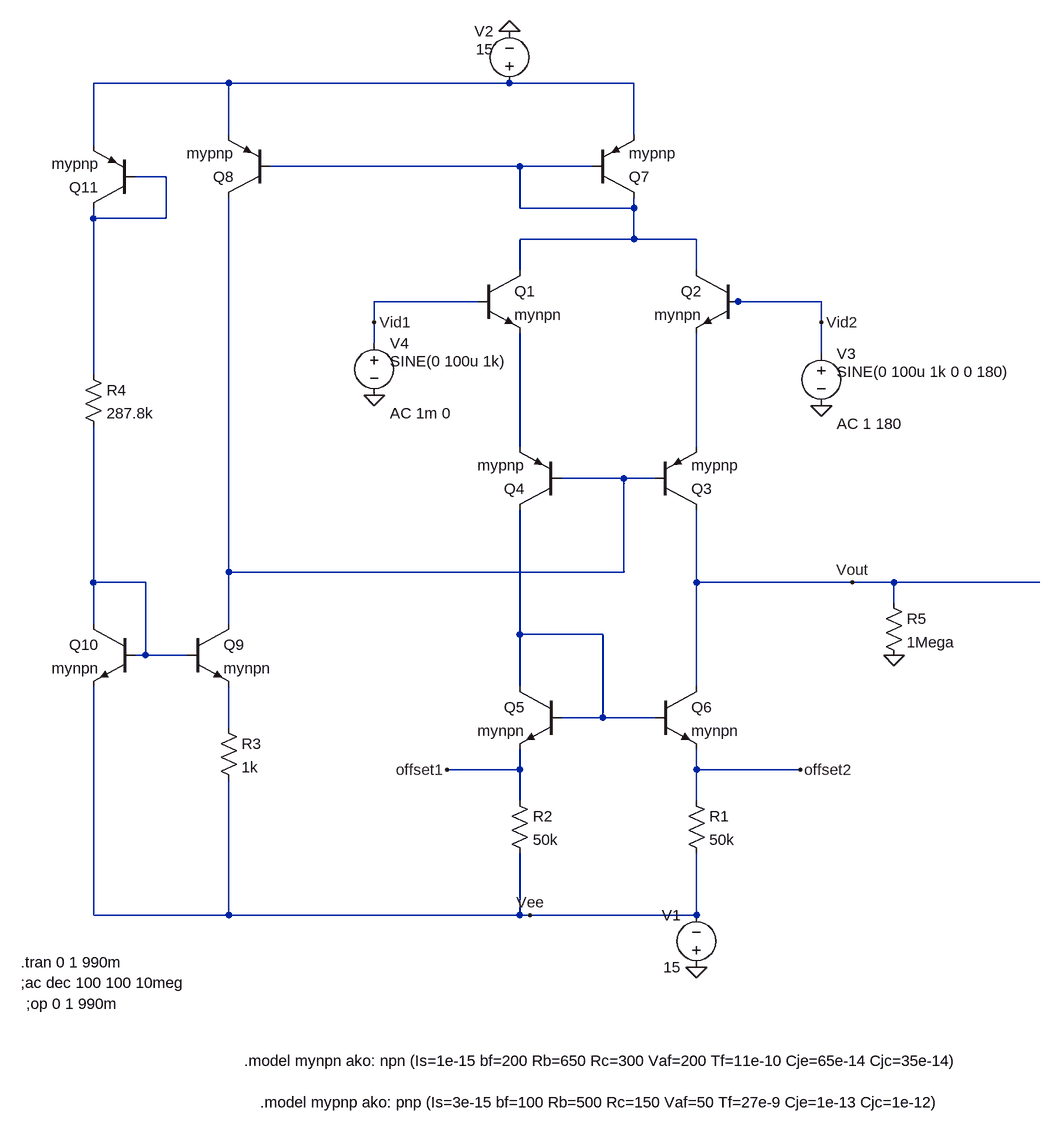
[diagram p0: schematic main circuit without offset.asc]
main circuit without offset.asc, the LTspice schematic file:
Version 4
SHEET 1 1844 1424
WIRE -272 -160 -480 -160
WIRE 160 -160 -272 -160
WIRE 352 -160 160 -160
WIRE -272 -80 -272 -160
WIRE 352 -80 352 -160
WIRE -480 -64 -480 -160
WIRE 176 -32 -208 -32
WIRE 288 -32 176 -32
WIRE -368 -16 -416 -16
WIRE 176 32 176 -32
WIRE 352 32 352 16
WIRE 352 32 176 32
WIRE -480 48 -480 32
WIRE -368 48 -368 -16
WIRE -368 48 -480 48
WIRE 352 80 352 32
WIRE 352 80 176 80
WIRE 448 80 352 80
WIRE 176 128 176 80
WIRE 448 128 448 80
WIRE 112 176 -48 176
WIRE 512 176 496 176
WIRE 640 176 512 176
WIRE -48 208 -48 176
WIRE 640 208 640 176
WIRE -48 240 -48 208
WIRE 640 256 640 208
WIRE -480 288 -480 48
WIRE 176 400 176 224
WIRE 448 400 448 224
WIRE 336 448 240 448
WIRE 384 448 336 448
WIRE -272 592 -272 16
WIRE 336 592 336 448
WIRE 336 592 -272 592
WIRE -480 608 -480 368
WIRE -400 608 -480 608
WIRE 448 608 448 496
WIRE 688 608 448 608
WIRE 752 608 688 608
WIRE 976 608 752 608
WIRE 752 640 752 608
WIRE -480 672 -480 608
WIRE -272 672 -272 592
WIRE 176 688 176 496
WIRE 304 688 176 688
WIRE -400 720 -400 608
WIRE -400 720 -416 720
WIRE -336 720 -400 720
WIRE 176 768 176 688
WIRE 448 768 448 608
WIRE 304 816 304 688
WIRE 304 816 240 816
WIRE 384 816 304 816
WIRE -272 832 -272 768
WIRE 176 896 176 864
WIRE 176 896 64 896
WIRE 448 896 448 864
WIRE 608 896 448 896
WIRE 176 944 176 896
WIRE 448 944 448 896
WIRE -480 1120 -480 768
WIRE -272 1120 -272 912
WIRE -272 1120 -480 1120
WIRE 176 1120 176 1024
WIRE 176 1120 -272 1120
WIRE 192 1120 176 1120
WIRE 448 1120 448 1024
WIRE 448 1120 192 1120
FLAG 752 720 0
FLAG 160 -240 0
FLAG 448 1200 0
FLAG -48 320 0
FLAG 640 336 0
FLAG -48 208 Vid1
FLAG 640 208 Vid2
FLAG 688 608 Vout
FLAG 64 896 offset1
FLAG 608 896 offset2
FLAG 192 1120 Vee
SYMBOL npn 112 128 R0
SYMATTR InstName Q1
SYMATTR Value mynpn
SYMBOL npn 512 128 M0
SYMATTR InstName Q2
SYMATTR Value mynpn
SYMBOL pnp 384 496 M180
SYMATTR InstName Q3
SYMATTR Value mypnp
SYMBOL pnp 240 496 R180
SYMATTR InstName Q4
SYMATTR Value mypnp
SYMBOL pnp 288 16 M180
SYMATTR InstName Q7
SYMATTR Value mypnp
SYMBOL pnp -208 16 R180
SYMATTR InstName Q8
SYMATTR Value mypnp
SYMBOL npn -336 672 R0
SYMATTR InstName Q9
SYMATTR Value mynpn
SYMBOL npn -416 672 M0
SYMATTR InstName Q10
SYMATTR Value mynpn
SYMBOL pnp -416 32 R180
SYMATTR InstName Q11
SYMATTR Value mypnp
SYMBOL res 432 928 R0
SYMATTR InstName R1
SYMATTR Value 50k
SYMBOL res 160 928 R0
SYMATTR InstName R2
SYMATTR Value 50k
SYMBOL res -288 816 R0
SYMATTR InstName R3
SYMATTR Value 1k
SYMBOL res -496 272 R0
SYMATTR InstName R4
SYMATTR Value 287.8k
SYMBOL res 736 624 R0
SYMATTR InstName R5
SYMATTR Value 1Mega
SYMBOL voltage 448 1216 R180
WINDOW 0 24 96 Left 2
WINDOW 3 24 16 Left 2
WINDOW 123 0 0 Left 0
WINDOW 39 0 0 Left 0
SYMATTR InstName V1
SYMATTR Value 15
SYMBOL voltage 160 -144 R180
WINDOW 0 24 96 Left 2
WINDOW 3 24 68 Left 2
WINDOW 123 0 0 Left 0
WINDOW 39 0 0 Left 0
SYMATTR InstName V2
SYMATTR Value 15
SYMBOL voltage 640 240 R0
WINDOW 123 24 124 Left 2
WINDOW 39 0 0 Left 0
WINDOW 3 24 44 Left 2
SYMATTR Value2 AC 1 180
SYMATTR Value SINE(0 100u 1k 0 0 180)
SYMATTR InstName V3
SYMBOL voltage -48 224 R0
WINDOW 123 24 124 Left 2
WINDOW 39 0 0 Left 0
WINDOW 3 24 44 Left 2
SYMATTR Value2 AC 1m 0
SYMATTR Value SINE(0 100u 1k)
SYMATTR InstName V4
SYMBOL npn 240 768 M0
SYMATTR InstName Q5
SYMATTR Value mynpn
SYMBOL npn 384 768 R0
SYMATTR InstName Q6
SYMATTR Value mynpn
TEXT -224 1408 Left 2 !.model mypnp ako: pnp (Is=3e-15 bf=100 Rb=500 Rc=150 Vaf=50 Tf=27e-9 Cje=1e-13 Cjc=1e-12)
TEXT -248 1344 Left 2 !.model mynpn ako: npn (Is=1e-15 bf=200 Rb=650 Rc=300 Vaf=200 Tf=11e-10 Cje=65e-14 Cjc=35e-14)
TEXT -592 1224 Left 2 !;ac dec 100 100 10meg
TEXT -584 1256 Left 2 !;op 0 1 990m
TEXT -592 1192 Left 2 !.tran 0 1 990m

The netlist it stands for:
* main circuit without offset.asc
Q1 N002 Vid1 N004 0 mynpn
Q2 N002 Vid2 N005 0 mynpn
Q3 Vout N006 N005 0 mypnp
Q4 N008 N006 N004 0 mypnp
Q7 N002 N002 N001 0 mypnp
Q8 N006 N002 N001 0 mypnp
Q9 N006 N007 N009 0 mynpn
Q10 N007 N007 Vee 0 mynpn
Q11 N003 N003 N001 0 mypnp
R1 offset2 Vee 50k
R2 offset1 Vee 50k
R3 N009 Vee 1k
R4 N003 N007 287.8k
R5 Vout 0 1Mega
V1 0 Vee 15
V2 N001 0 15
V3 Vid2 0 SINE(0 100u 1k 0 0 180) AC 1 180
V4 Vid1 0 SINE(0 100u 1k) AC 1m 0
Q5 N008 N008 offset1 0 mynpn
Q6 Vout N008 offset2 0 mynpn
.model NPN NPN
.model PNP PNP
.lib standard.bjt
.model mypnp ako: pnp (Is=3e-15 bf=100 Rb=500 Rc=150 Vaf=50 Tf=27e-9 Cje=1e-13 Cjc=1e-12)
.model mynpn ako: npn (Is=1e-15 bf=200 Rb=650 Rc=300 Vaf=200 Tf=11e-10 Cje=65e-14 Cjc=35e-14)
;ac dec 100 100 10meg
;op 0 1 990m
.tran 0 1 990m
.backanno
.end